# EAGLE design untitled (EAGLE 9.6.2)
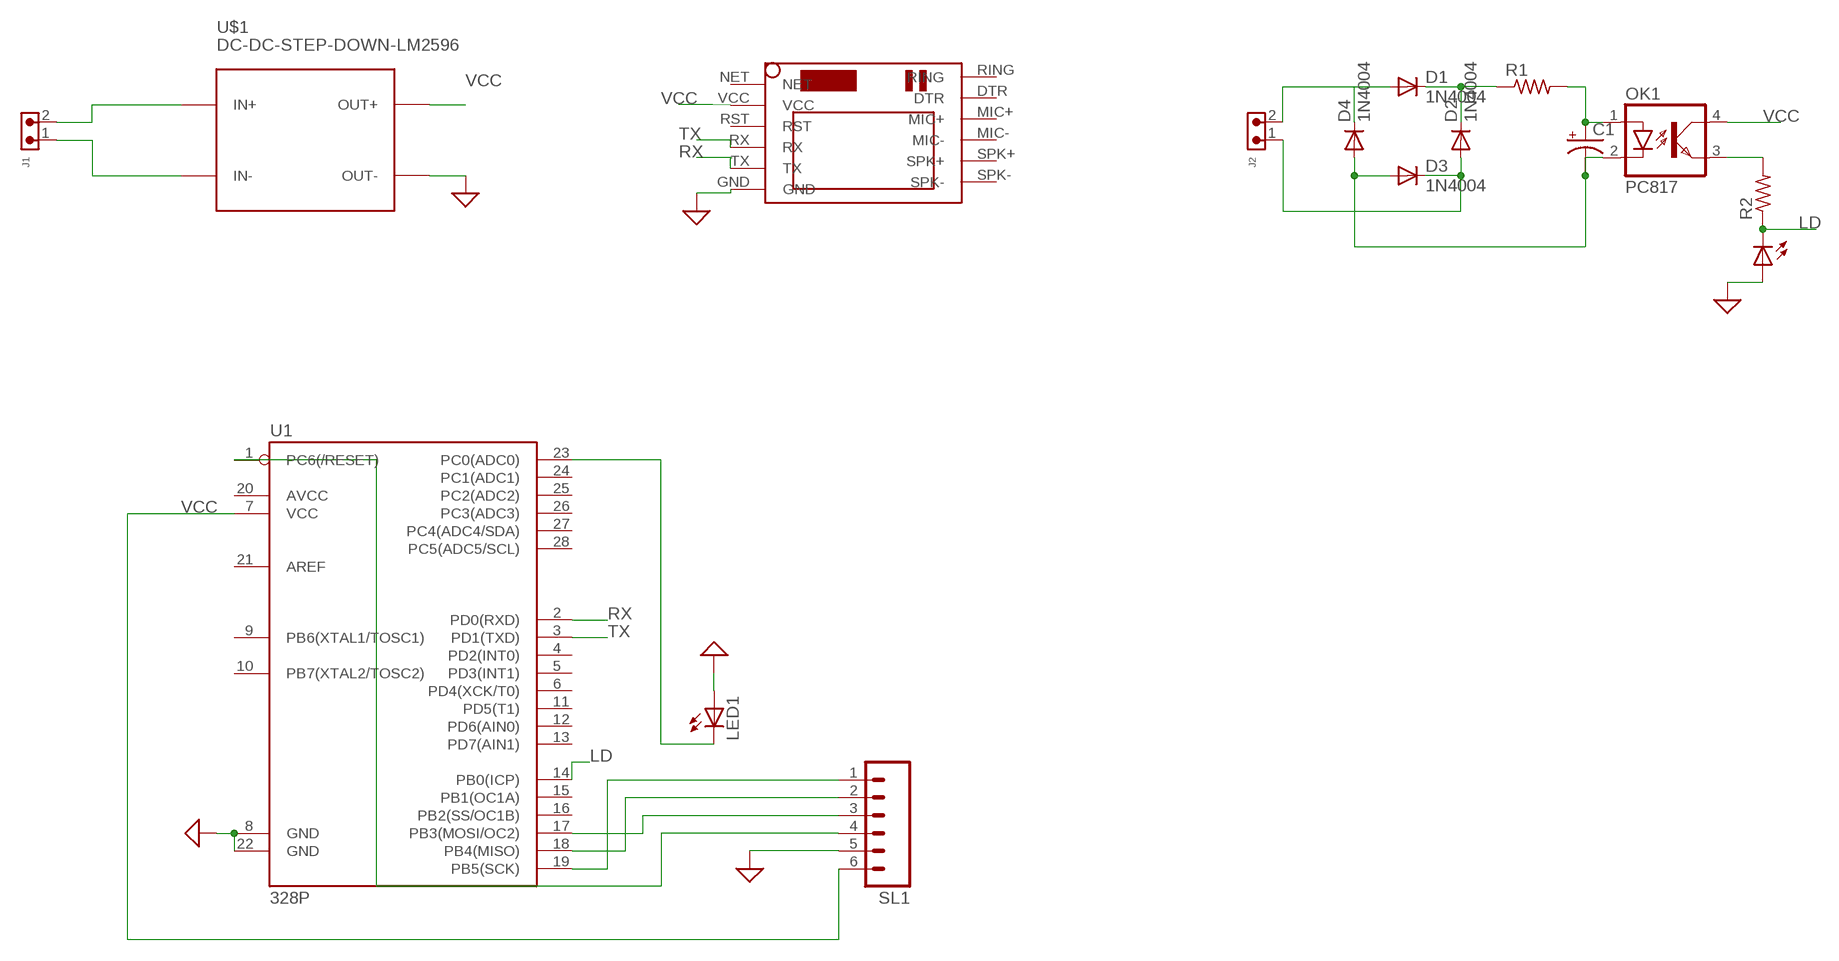
[diagram p0: schematic, sheet 1]

## Parts
C1  CPOL-USE2.5-5  [E2,5-5]
D1  1N4004  [DO41-10]
D2  1N4004  [DO41-10]
D3  1N4004  [DO41-10]
D4  1N4004  [DO41-10]
J1  691305530002  [691305530002]
J2  691305530002  [691305530002]
LED1  LED5MM  [LED5MM]
LED2  LED5MM  [LED5MM]
OK1  PC817  [DIL04]
R1  R-US_0207/10  [0207/10]
R2  R-US_0207/10  [0207/10]
SL1  M06  [06P]
U1  328P  ATMEGA328P_PDIP  [DIP28]
U$1  DC-DC-STEP-DOWN-LM2596  [DC-DC-STEP-DOWN-LM2596]
U$2  SIM800LMODULE  [SIM800LMODULE]

## Nets
GND: LED1.A LED2.A SL1.5 U1.8(GND) U1.22(GND) U$1.OUT- U$2.GND ; supply symbol labelled SUP
LD: LED2.K(C) OK1.3(EMIT) R2.1 R2.2 U1.14(PB0(ICP))
N$1: J1.2 U$1.IN+
N$2: J1.1 U$1.IN-
N$3: D1.A D4.C J2.2
N$4: SL1.1 U1.19(PB5(SCK))
N$5: SL1.2 U1.18(PB4(MISO))
N$6: SL1.3 U1.17(PB3(MOSI/OC2))
N$7: SL1.4 U1.1(PC6(/RESET))
N$8: LED1.K(C) U1.23(PC0(ADC0))
N$9: D1.C D2.C R1.1
N$10: D2.A D3.C J2.1
N$11: C1.- D3.A D4.A OK1.2(C)
N$12: C1.+ OK1.1(A) R1.2
RX: U1.2(PD0(RXD)) U$2.TX
TX: U1.3(PD1(TXD)) U$2.RX
VCC: OK1.4(COL) SL1.6 U1.7(VCC) U$1.OUT+ U$2.VCC
Unconnected: U1.4(PD2(INT0)) U1.5(PD3(INT1)) U1.6(PD4(XCK/T0)) U1.9(PB6(XTAL1/TOSC1)) U1.10(PB7(XTAL2/TOSC2)) U1.11(PD5(T1)) U1.12(PD6(AIN0)) U1.13(PD7(AIN1)) U1.15(PB1(OC1A)) U1.16(PB2(SS/OC1B)) U1.20(AVCC) U1.21(AREF) U1.24(PC1(ADC1)) U1.25(PC2(ADC2)) U1.26(PC3(ADC3)) U1.27(PC4(ADC4/SDA)) U1.28(PC5(ADC5/SCL)) U$2.DTR U$2.MIC+ U$2.MIC- U$2.NET U$2.RING U$2.RST U$2.SPK+ U$2.SPK-

## Library data of the parts
C1 = rcl:CPOL-US: POLARIZED CAPACITOR, American symbol; SPICEPREFIX: C
D1-D4 = adafruit:1N4004: DIODE General purpose 1N400x type rectifier (With bigger pads) http://www.ladyada.net/library/pcb/eaglelibrary.html
J1 J2 = Wurth_Connectors_WR-TBL Pluggable Connector:691305530002: WR-TBL Serie 3055 - 5,08 mm - PCB Header Vertical Entry with Plastic Latches KIND PROPERTIES Pitch 5.08 mm MATERIAL PROPERTIES Insulator Material PA66 Insulator Flammability Rating UL94 V-0 Insulator Color Green Terminal Material Copper Alloy Terminal Plating Tin-plated surface GENERAL INFORMATION Operating Temperature -40 up to +105 °C ELECTRICAL PROPERTIES IR UL 16 A Working Voltage [UL] 300 V (AC) Withstanding Voltage [UL] 2500 V (AC) Contact Resistance [UL] 20 mΩ CERTIFICATION UL Approval E315414 <https://www.we-online.com/catalog/media/o135349v209%20Family_WR-TBL3_6913055300xx.jpg> Details see: https://www.we-online.com/catalog/en/TBL_5_08_3055_6913055300XX/ Updated by Ella Wu 2019-12-30 2019(C) Wurth Elektronik; DATASHEET-URL: https://www.we-online.com/catalog/datasheet/691305530002.pdf; IR-UL: 16A; MOUNT: THT; PART-NUMBER: 691305530002; PINS: 2; PITCH: 5.08mm; TYPE: Vertical; WORKING-VOLTAGE-UL: 300V (AC)
LED1 LED2 = adafruit:LED: LED OSRAM: - CHIPLED LG R971, LG N971, LY N971, LG Q971, LY Q971, LO R971, LY R971 LH N974, LH R974 LS Q976, LO Q976, LY Q976 LO Q996 - Hyper CHIPLED LW Q18S LB Q993, LB Q99A, LB R99A - SideLED LS A670, LO A670, LY A670, LG A670, LP A670 LB A673, LV A673, LT A673, LW A673 LH A674 LY A675 LS A676, LA A676, LO A676, LY A676, LW A676 LS A679, LY A679, LG A679 - Hyper Micro SIDELED® LS Y876, LA Y876, LO Y876, LY Y876 LT Y87S - SmartLED LW L88C, LW L88S LB L89C, LB L89S, LG L890 LS L89K, LO L89K, LY L89K LS L896, LA L896, LO L896, LY L896 - TOPLED LS T670, LO T670, LY T670, LG T670, LP T670 LSG T670, LSP T670, LSY T670, LOP T670, LYG T670 LG T671, LOG T671, LSG T671 LB T673, LV T673, LT T673, LW T673 LH T674 LS T676, LA T676, LO T676, LY T676, LB T676, LH T676, LSB T676, LW T676 LB T67C, LV T67C, LT T67C, LS T67K, LO T67K, LY T67K, LW E67C LS E67B, LA E67B, LO E67B, LY E67B, LB E67C, LV E67C, LT E67C LW T67C LS T679, LY T679, LG T679 LS T770, LO T770, LY T770, LG T770, LP T770 LB T773, LV T773, LT T773, LW T773 LH T774 LS E675, LA E675, LY E675, LS T675 LS T776, LA T776, LO T776, LY T776, LB T776 LHGB T686 LT T68C, LB T68C - Hyper Mini TOPLED® LB M676 - Mini TOPLED Santana® LG M470 LS M47K, LO M47K, LY M47K Source: http://www.osram.convergy.de/
OK1 = optocoupler:PC817: SHARP OPTO COUPLER; MPN: PC817X4J000F; OC_FARNELL: 9707727; OC_NEWARK: 97K7059
R1 R2 = BeagleBone_Black_Wireless:R-US_: RESISTOR, American symbol
SL1 = con-amp-quick:M06: AMP QUICK CONNECTOR; OC_FARNELL: unknown; OC_NEWARK: unknown
U1 = SparkFun-IC-Microcontroller:ATMEGA328P_PDIP: Atmel 328P Through hole ATMEGA328P uC used in the Arduino 32kb flash, 1k EEPROM, 2k SRAM Datasheet <http://www.sparkfun.com/datasheets/Components/SMD/ATMega328.pdf> SparkFun Products Storefront component: AVR 28 Pin 20MHz 32K 6A/D - ATMega328P <https://www.sparkfun.com/products/9061> (COM-09061) SparkFun Simon Says - Through-Hole Soldering Kit <https://www.sparkfun.com/products/10547> (KIT-10547) SparkFun Learn to Solder - Simon Says <https://www.sparkfun.com/products/13708> (KIT-13708) SparkFun BigTime Watch Kit <https://www.sparkfun.com/products/11734> (KIT-11734) SparkFun ClockIt <https://www.sparkfun.com/products/10930> (KIT-10930) SparkFun Serial Enabled LCD Kit <https://www.sparkfun.com/products/10097> (LCD-10097) SparkFun Simon Tilts - Through Hole Soldering Kit <https://www.sparkfun.com/products/12634> (KIT-12634) SparkFun Frequency Counter Kit <https://www.sparkfun.com/products/10140> (KIT-10140) FabFM Radio Kit <https://www.sparkfun.com/products/11043> (KIT-11043) SparkFun Binary Blaster Kit <https://www.sparkfun.com/products/12037> (KIT-12037) SparkFun Metro-Gnome <https://www.sparkfun.com/products/9236> (KIT-09236) ATmega328 with Arduino Optiboot (Uno) <https://www.sparkfun.com/products/10524> (DEV-10524); PROD_ID: IC-09136
U$1 = diy-modules:DC-DC-STEP-DOWN-LM2596: DC/DC Step-Down Regulator based on LM2596-ADJ chip LM2596 datasheet available here: http://www.ti.com/lit/ds/symlink/lm2596.pdf Click here to find device on ebay.com <http://www.ebay.com/sch/lm2596+power+regulator>
U$2 = SIM800LMODULE:SIM800LMODULE: SIM800L Module

## Board
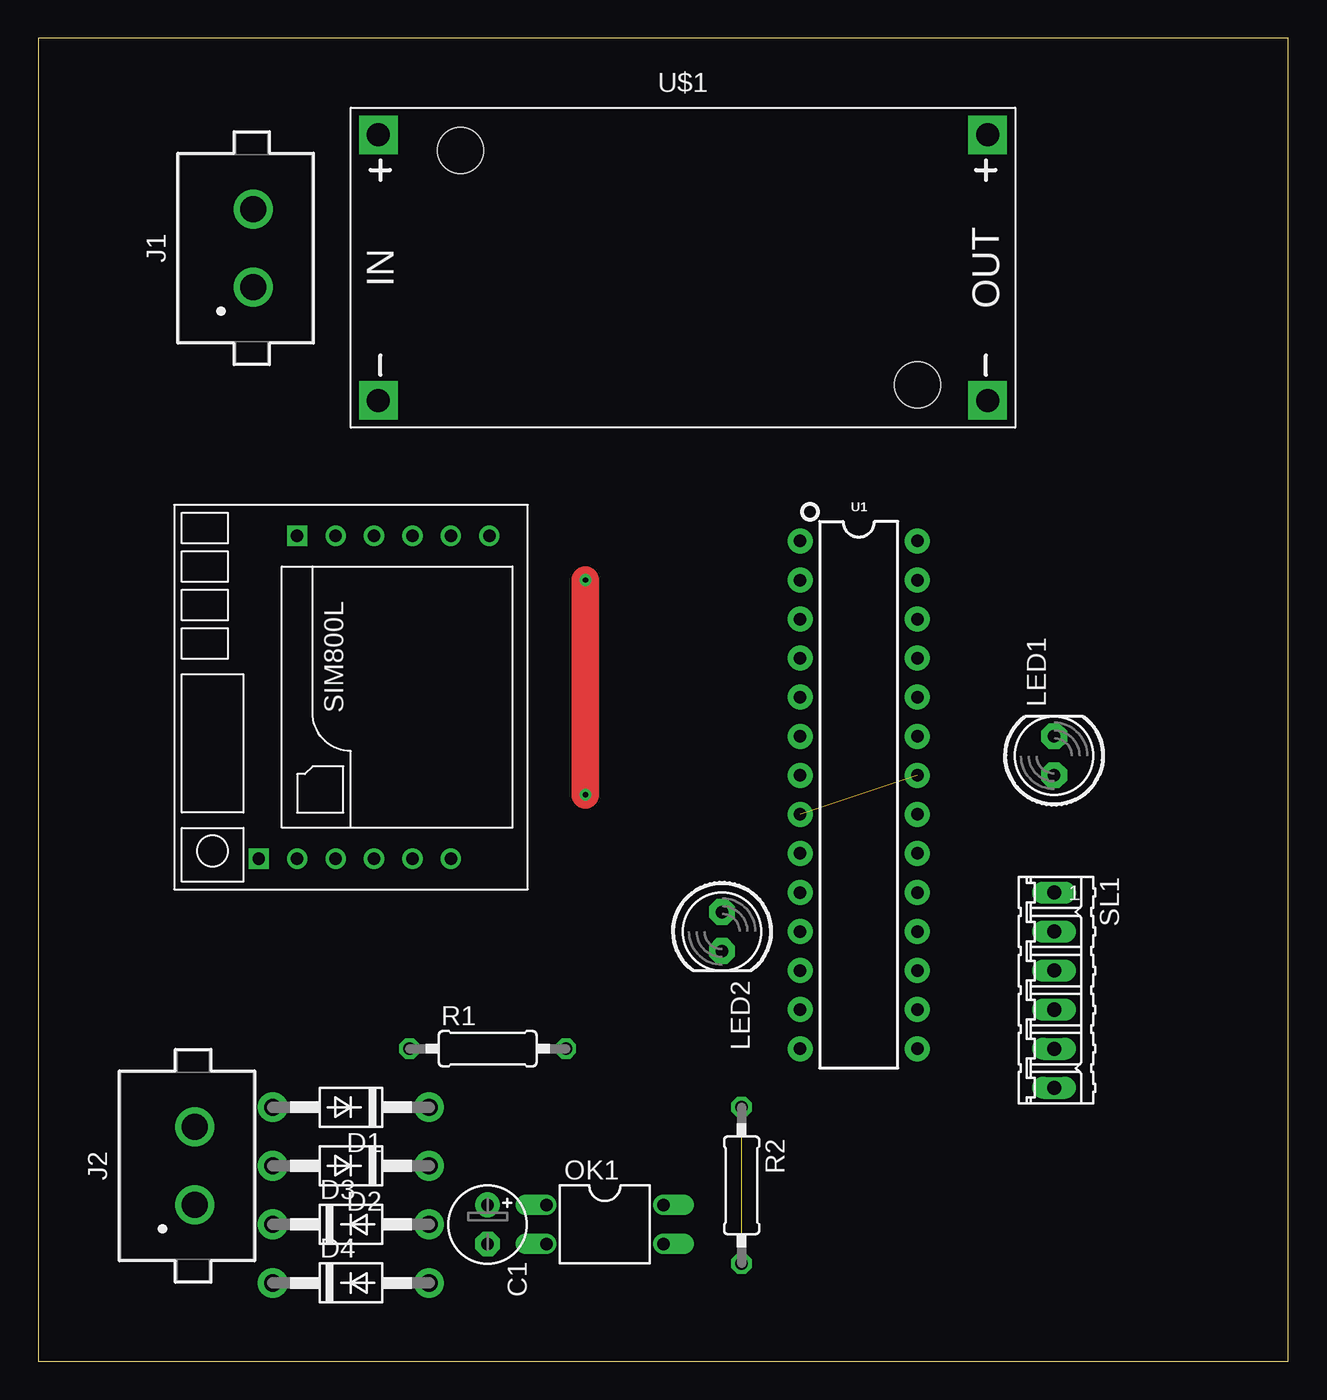
[diagram p1: board, top side]
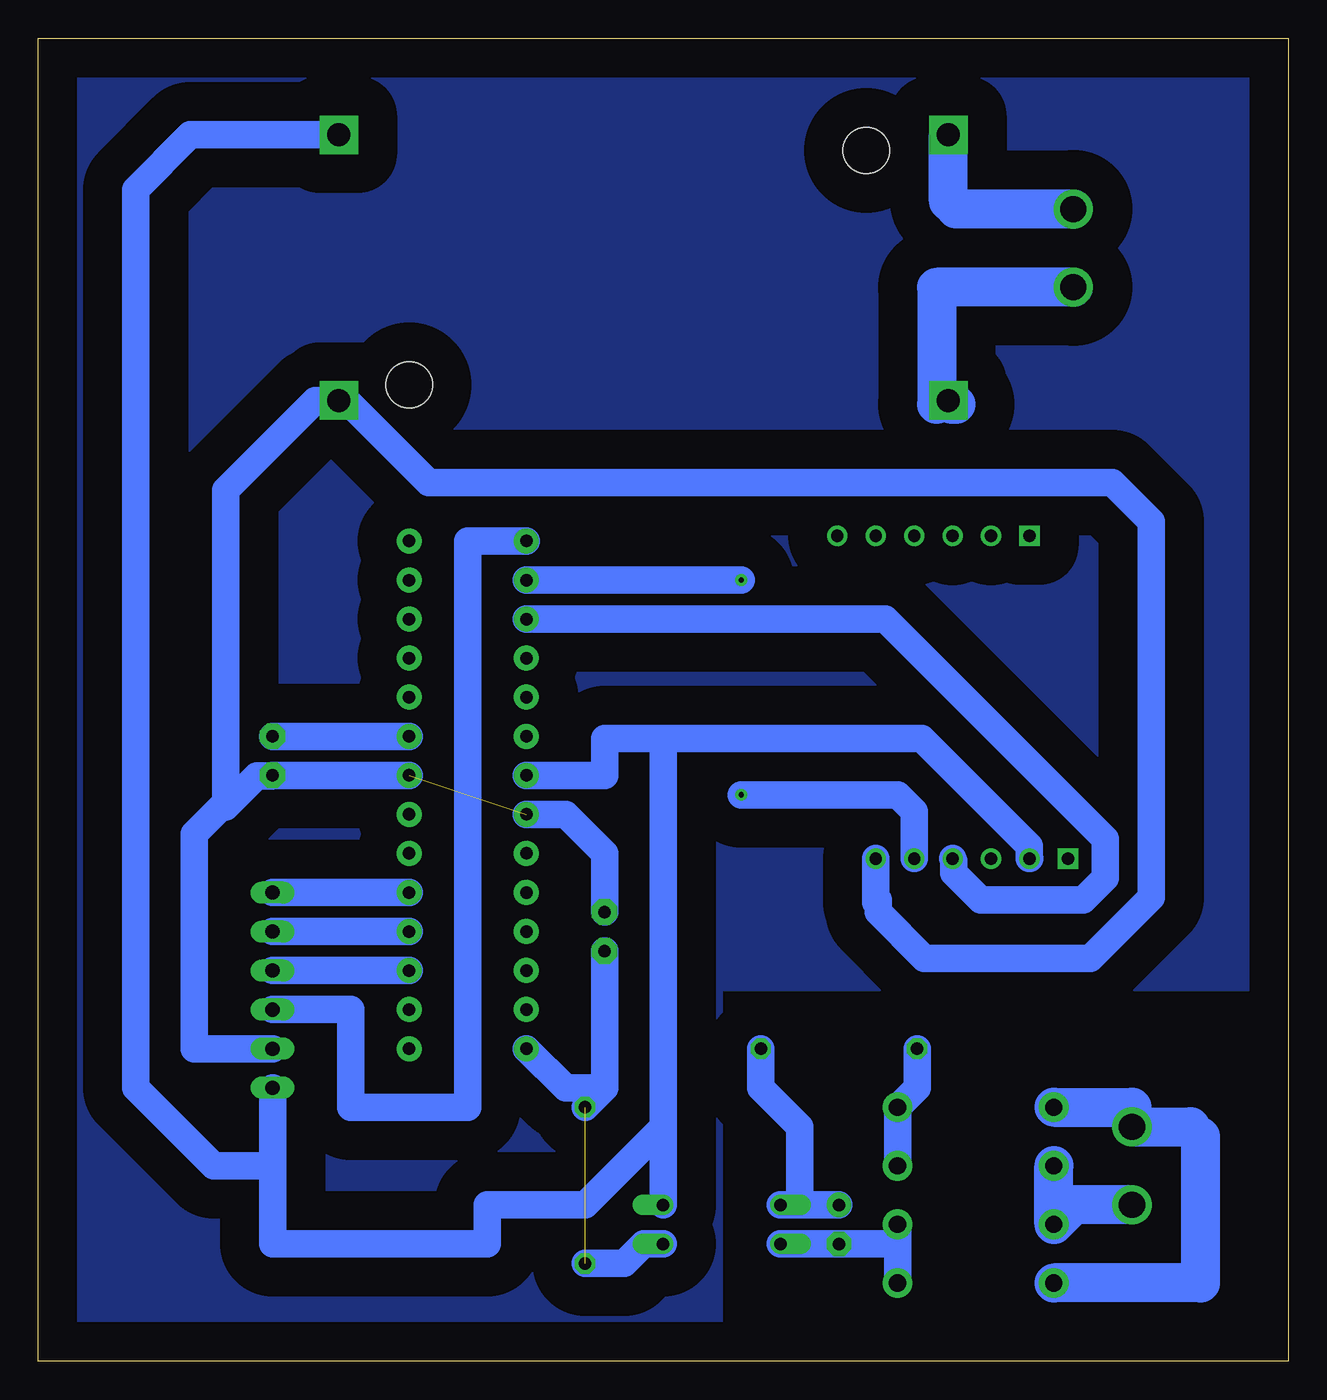
[diagram p2: board, bottom side, seen from below]

Size 81.26 x 86.03 mm. Coordinates in mm from the lower left corner, seen from the top.
Outline: 0,0 81.26,0 81.26,86.03 0,86.03 0,0
Copper layers (1*16): Top 0.035mm / dielectric 1.5mm / Bottom 0.035mm
Design rules "default *": minimum track width 70mil, minimum drill 0.35mm, track to track 30mil, track to pad 30mil, pad to pad 30mil, via to via 30mil, smd to smd 6mil, copper to edge 40mil, drill to drill 6mil, minimum pad ring 10mil, minimum via ring 8mil, stop-mask expansion 4mil, vias tented up to drill 0mil, thermal gap 10mil

### Footprints (pad centres in the part's own frame; a part is rotated, then mirrored left to right if it is on the bottom)
E2,5-5 = drill 0.813 pad 1.6: + -1.27,0 | drill 0.813 pad 1.6 octagon: - 1.27,0
DO41-10 = drill 1.118 pad 1.93: A 5.08,0; C -5.08,0
691305530002 = drill 1.7: 1 -2.54,0; 2 2.54,0
LED5MM = drill 0.813 pad 1.676 octagon: A -1.27,0; K 1.27,0
DIL04 = drill 0.813 offset: 1 -1.27,-3.81; 2 1.27,-3.81; 3 1.27,3.81; 4 -1.27,3.81
0207/10 = drill 0.813 octagon: 1 -5.08,0; 2 5.08,0
06P = drill 0.914 long: 1 -6.35,0; 2 -3.81,0; 3 -1.27,0; 4 1.27,0; 5 3.81,0; 6 6.35,0
DIP28 = drill 0.813 pad 1.626: 1 -16.51,-3.81; 2 -13.97,-3.81; 3 -11.43,-3.81; 4 -8.89,-3.81; 5 -6.35,-3.81; 6 -3.81,-3.81; 7 -1.27,-3.81; 8 1.27,-3.81; 9 3.81,-3.81; 10 6.35,-3.81; 11 8.89,-3.81; 12 11.43,-3.81; 13 13.97,-3.81; 14 16.51,-3.81; 15 16.51,3.81; 16 13.97,3.81; 17 11.43,3.81; 18 8.89,3.81; 19 6.35,3.81; 20 3.81,3.81; 21 1.27,3.81; 22 -1.27,3.81; 23 -3.81,3.81; 24 -6.35,3.81; 25 -8.89,3.81; 26 -11.43,3.81; 27 -13.97,3.81; 28 -16.51,3.81
DC-DC-STEP-DOWN-LM2596 = drill 1.5 pad 2.5 square: IN+ -19.812,8.636; IN- -19.812,-8.636; OUT+ 19.812,8.636; OUT- 19.812,-8.636 | hole 3: -14.478,7.62; 15.24,-7.62
SIM800LMODULE = drill 0.8: DTR 10.5,1; GND -10.5,-6.5; MIC+ 10.5,-1.5; MIC- 10.5,-4; RST -10.5,1; RX -10.5,-1.5; SPK+ 10.5,-6.5; SPK- 10.5,-9; TX -10.5,-4; VCC -10.5,3.5 | drill 0.8 square: NET -10.5,6; RING 10.5,3.5

### Placement (x,y rotation side)
C1  29.21,8.89 270 top
D1  20.32,16.51 180 top
D2  20.32,12.7 180 top
D3  20.32,8.89 0 top
D4  20.32,5.08 0 top
J1  13.97,72.39 90 top
J2  10.16,12.7 90 top
LED1  66.04,39.37 90 top
LED2  44.45,27.94 270 top
OK1  36.83,8.89 270 top
R1  29.21,20.32 0 top
R2  45.72,11.43 270 top
SL1  66.04,24.13 270 top
U1  53.34,36.83 270 top
U$1  41.91,71.12 0 top
U$2  20.32,43.18 90 top

### Tracks (layer width: path | path; a pad name or v marks a point on that pad's centre or on a via)
GND  (1 unrouted)
  Bottom 1.778: U1.22 LED1.A 66.09,38.05 67.07,38.05 69.07,36.05 | 69.07,36.05 69.07,56.66 63.25,62.48 U$1.OUT- 61.21,62.48 55.88,57.15 11.43,57.15 8.89,54.61 8.89,30.16 12.86,26.19 23.65,26.19 26.67,29.21 26.67,30 26.82,29.84 U$2.GND | SL1.5 71.12,20.32 71.12,34.29 69.36,36.05 69.07,36.05 | LED2.A 44.45,33.02 46.99,35.56 U1.8
LD  (1 unrouted)
  Bottom 1.778: OK1.3 41.91,7.62 43.18,6.35 R2.2 | R2.1 44.45,17.78 | LED2.K 44.45,17.78 | 44.45,17.78 46.99,17.78 U1.14
N$1
  Bottom 1.778: 21.59,74.93 22.1,75.44
  Bottom 2.54: J1.2 21.59,74.93 | 22.1,75.44 U$1.IN+
N$2
  Bottom 1.778: J1.1 21.59,69.85 22.86,68.58 22.86,62.23 22.22,62.23 | 21.59,62.23 22.22,62.23 | U$1.IN- 22.22,62.55 22.22,62.23
  Bottom 2.54: J1.1 22.86,69.85 22.86,62.23 | U$1.IN- 21.84,62.23 21.59,62.23
N$3
  Bottom 1.778: J2.2 11.43,16.51 D1.A | 6.35,15.24 5.71,14.61
  Bottom 2.54: D1.A 10.16,16.51 | J2.2 6.35,15.24 | 5.71,14.61 5.71,5.08 D4.C
N$4
  Bottom 1.778: U1.19 SL1.1
N$5
  Bottom 1.778: U1.18 SL1.2
N$6
  Bottom 1.778: U1.17 SL1.3
N$7
  Bottom 1.778: U1.1 53.34,53.34 53.34,16.51 60.96,16.51 60.96,22.86 SL1.4
N$8
  Bottom 1.778: LED1.K U1.23
N$9
  Bottom 1.778: D2.C D1.C 24.13,17.78 R1.1
N$10
  Bottom 2.54: J2.1 13.97,10.16 D3.C D2.A
N$11
  Bottom 1.778: D3.A 25.4,7.62 | 25.4,7.62 D4.A | 25.4,7.62 27.94,7.62 C1.- OK1.2
N$12
  Bottom 1.778: R1.2 34.29,17.78 31.75,15.24 31.75,10.16 | 31.75,10.16 OK1.1 | C1.+ 31.75,10.16
N$13
  pour Bottom (isolate 2.54): 0,86.36 81.28,86.36 81.28,0 36.83,0 36.83,24.13 0,24.13
RX  (via drill 0.35)
  Top 1.778: v35.56,50.8 v35.56,36.83
  Bottom 1.778: U$2.TX 24.32,35.75 25.4,36.83 v35.56,36.83 | v35.56,50.8 U1.2
TX
  Bottom 1.778: U1.3 26.19,48.26 11.91,33.97 11.91,31.43 13.34,30 20,30 21.75,31.75 21.75,32.54 U$2.RX
VCC
  Bottom 1.778: U$1.OUT+ 71.37,79.76 74.93,76.2 74.93,17.78 69.85,12.7 66.04,12.7 | OK1.4 40.64,15.24 | U1.7 44.45,38.1 44.45,40.48 40.64,40.48 | 40.64,40.48 23.81,40.48 16.83,33.5 16.83,32.7 U$2.VCC | SL1.6 66.04,12.7 | 66.04,12.7 66.04,7.62 52.07,7.62 52.07,10.16 45.72,10.16 40.64,15.24 | 40.64,15.24 40.64,40.48